# Altium project DashDataDisplay.PrjPcb (part 1 of 2)
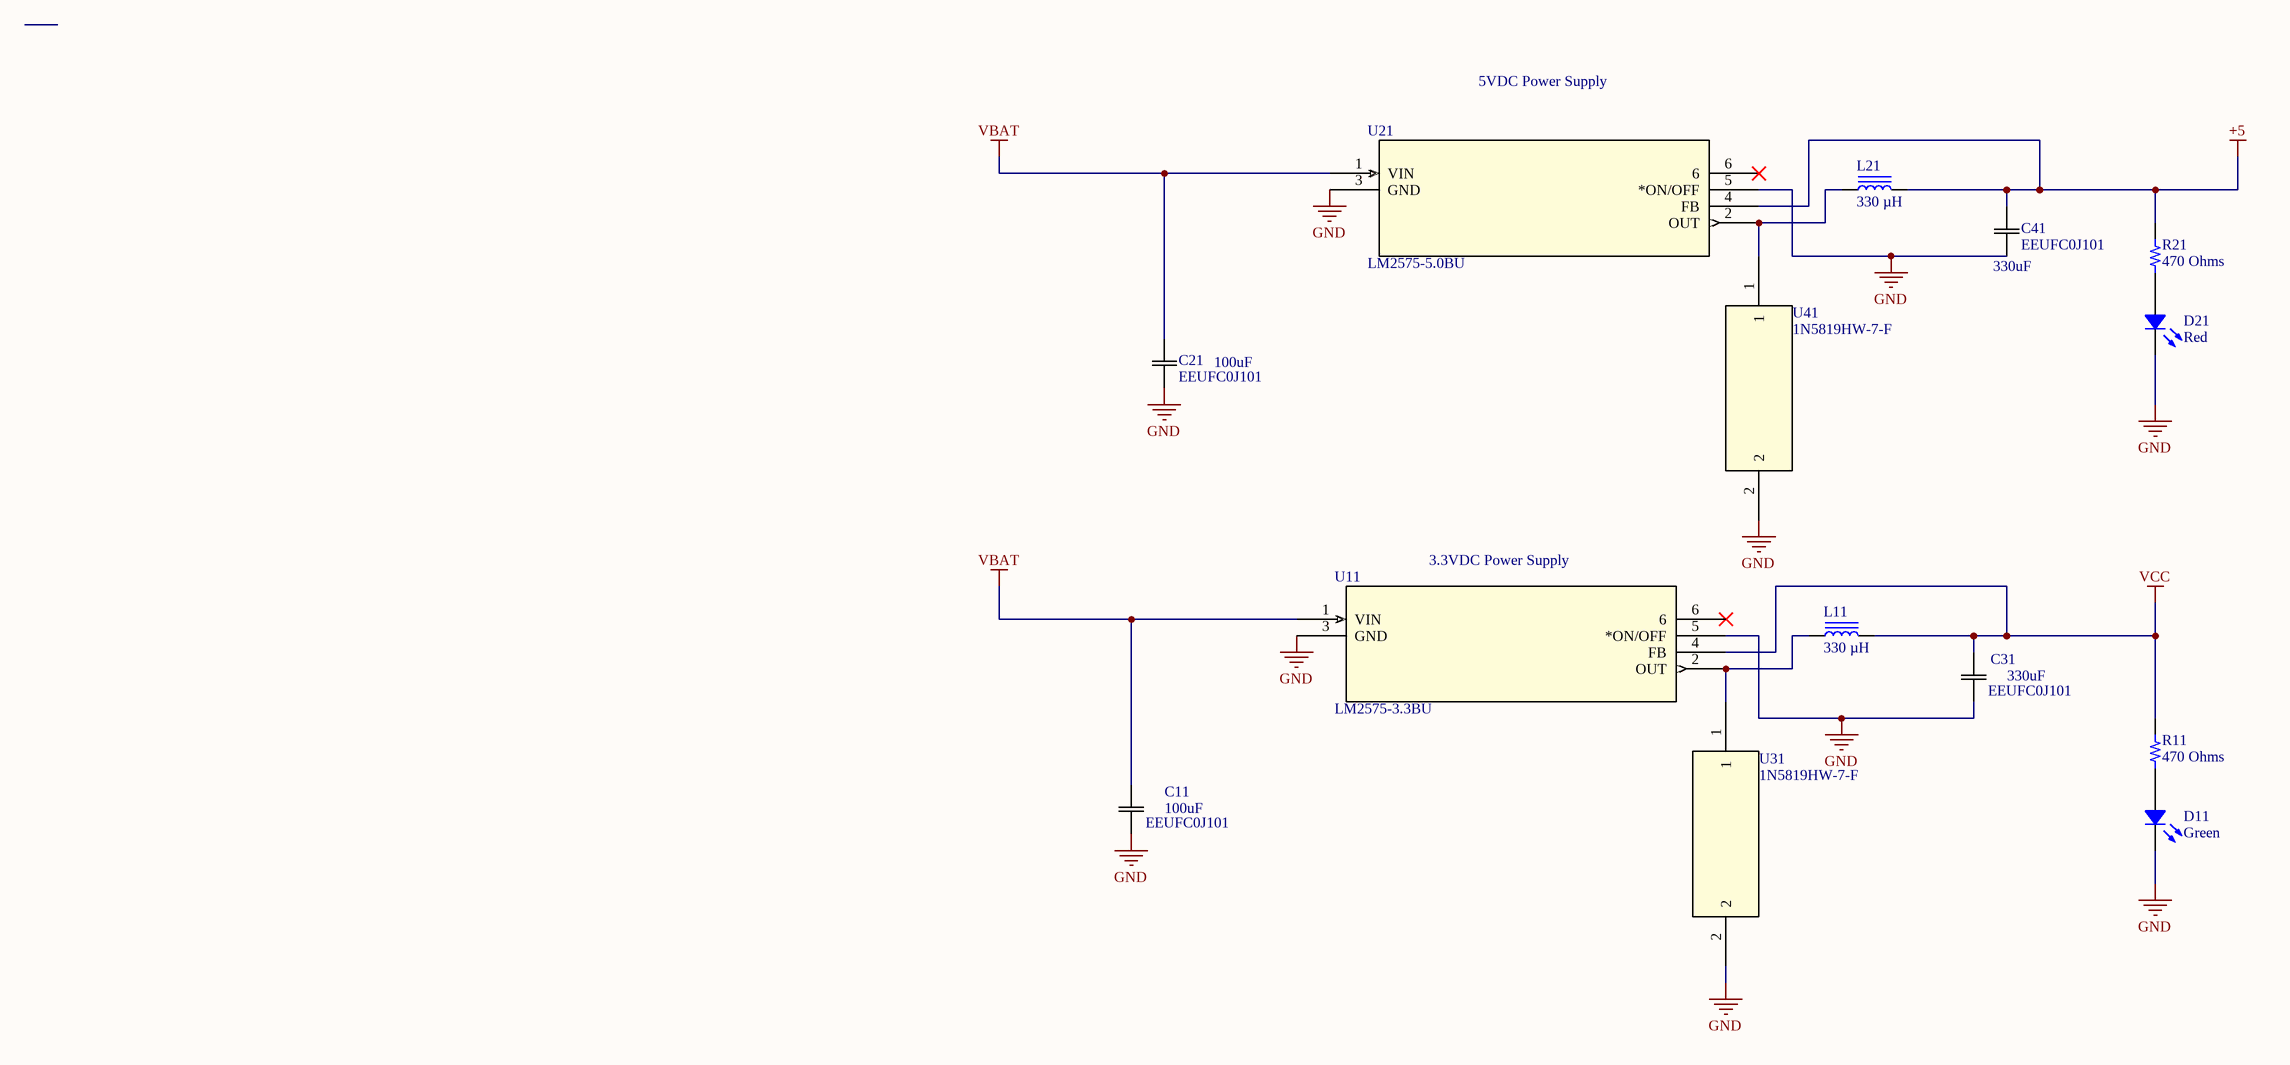
[diagram p0: PowerSupply.SchDoc]
9 sheets, 145 parts. Net scope: flat (ports and power ports of the same name join across sheets).
Board file: DashDataDisplayPCB.PcbDoc
Sheets:
  PowerSupply.SchDoc
  SensorCircuit.SchDoc
  CanTrcvCircuit.SchDoc
  LCDCircuit.SchDoc
  MCUCircuit.SchDoc
  ADCCircuit.SchDoc
  ThermoCoupleCircuit.SchDoc
  Connector.SchDoc
  ButtonCircuit.SchDoc

## Sheet PowerSupply.SchDoc
size A3; SheetNumber: 1; SheetTotal: 9

### Parts
C11  EEUFC0J101  value 100uF  [CAP_5 X 11_PAN]
C21  EEUFC0J101  value 100uF  [CAP_5 X 11_PAN]
C31  EEUFC0J101  value 330uF  [CAP_5 X 11_PAN]
C41  EEUFC0J101  value 330uF  [CAP_5 X 11_PAN]
D11  Green  [LED 1206_3216 GREEN]
D21  Red  [LED 1206_3216 RED]
L11  330 µH  [BOURNS SRR1280]
L21  330 µH  [BOURNS SRR1280]
R11  470 Ohms  [RES 0805_2012]
R21  470 Ohms  [RES 0805_2012]
U11  LM2575-3.3BU  [TO-263-5_MCL]
U21  LM2575-5.0BU  [TO-263-5_MCL-M]
U31  1N5819HW-7-F  [1N5819HW-7-F_DIO]
U41  1N5819HW-7-F  [1N5819HW-7-F_DIO]

### Nets
+5: C41.1 L21.2 R21.2 U21.4(FB)
GND: C11.2 C21.2 C31.2 C41.2 D11.2 D21.2 U11.3(GND) U11.5(*ON/OFF) U21.3(GND) U21.5(*ON/OFF) U31.2 U41.2
VBAT: C11.1 C21.1 U11.1(VIN) U21.1(VIN)
VCC: C31.1 L11.2 R11.2 U11.4(FB)
NetD11_1: D11.1 R11.1
NetD21_1: D21.1 R21.1
NetL11_1: L11.1 U11.2(OUT) U31.1
NetL21_1: L21.1 U21.2(OUT) U41.1

Not connected (* = marked no-connect by the designer): U11 6*; U21 6*

### Notes on the sheet
- 5VDC Power Supply
- (near U11) 3.3VDC Power Supply

### Library data of the parts
C11 C21 C31 C41 = EEUFC0J101: No Description Available; Mfr_Name: Panasonic
D11 = 597-6322-107F: LED GREEN 1206 SMD; Manufacturer: Dialight; Current - Test: 20mA; Lens Size: 1.20mm Dia; Lens Style: Round with Domed Top; Millicandela Rating: 1278.5mcd; Viewing Angle: 30°; Voltage - Forward (Vf) (Typ): 3.2V; Wavelength - Dominant: 525nm; Part Number: 597-6322-107F; Color: Green; ComponentLink1Description: Datasheet; ComponentLink1URL: https://s3-us-west-2.amazonaws.com/catsy.557/C18571.pdf; ComponentLink2Description: DigiKey Link; ComponentLink2URL: https://www.digikey.com/en/products/detail/dialight/597-6322-107F/16995758; Device Package: 1206 (3216 Metric); Height (Max): 1.73mm; LastUpdated: 6/3/2024 19:59:09; Lifecycle Status: Active; Minimum Order: 1; Mounting Type: Surface Mount; Package / Case: 1206 (3216 Metric); Packaging: TapeAndReel; PartId: 1292; Part Status: Active; Price: 0.17; Series: -; Size / Dimension: 3.20mm L x 1.60mm W; Supplier 1: DigiKey; Supplier Part Number 1: 350-597-6322-107FCT-ND; Supplier Device Package: 1206; Value: Green
D21 = 25-21/R6C-BR2S2B/2A: LED RED CLEAR 1206 SMD; Manufacturer: Everlight Electronics Co Ltd; Current - Test: 20mA; Lens Color: Colorless; Lens Size: 1.10mm Dia; Lens Style: Round with Domed Top; Millicandela Rating: 212.5mcd; Viewing Angle: 60°; Voltage - Forward (Vf) (Typ): 2.05V; Wavelength - Dominant: 624nm; Wavelength - Peak: 632nm; Part Number: 25-21/R6C-BR2S2B/2A; Color: Red; ComponentLink1Description: Datasheet; ComponentLink1URL: https://everlighteurope.com/index.php?controller=attachment&id_attachment=6134; ComponentLink2Description: DigiKey Link; ComponentLink2URL: https://www.digikey.com/en/products/detail/everlight-electronics-co-ltd/25-21-R6C-BR2S2B-2A/12177238; Device Package: 1206 (3216 Metric); Height (Max): 1.20mm; LastUpdated: 6/3/2024 20:00:40; Lens Transparency: Clear; Lifecycle Status: Active; Minimum Order: 1; Mounting Type: Surface Mount; Package / Case: 1206 (3216 Metric); Packaging: TapeAndReel; PartId: 1100; Part Status: Active; Price: 0.05; Series: -; Size / Dimension: 3.20mm L x 1.60mm W; Supplier 1: DigiKey; Supplier Part Number 1: 1080-25-21/R6C-BR2S2B/2ACT-ND; Supplier Device Package: 1206; Value: Red
L11 L21 = SRR1280-331K: FIXED IND 330UH 1.1A 600MOHM SMD; Manufacturer: Bourns Inc.; Current - Saturation: 1.4A; DC Resistance (DCR): 600mOhm Max; Frequency - Self Resonant: 2.9MHz; Inductance Frequency - Test: 100 kHz; Material - Core: Ferrite; Q @ Freq: 18 @ 796kHz; Shielding: Shielded; Tolerance: ±10%; Type: Drum Core, Wirewound; Part Number: SRR1280-331K; ComponentLink1Description: Datasheet; ComponentLink1URL: https://www.bourns.com/docs/Product-Datasheets/SRR1280.pdf; ComponentLink2Description: DigiKey Link; ComponentLink2URL: https://www.digikey.com/en/products/detail/bourns-inc/SRR1280-331K/1970010; Current Rating (Amps): 1.1 A; Device Package: Nonstandard; Height - Seated (Max): 0.315" (8.00mm); Inductance: 330 µH; LastUpdated: 6/3/2024 20:02:37; Lifecycle Status: Active; Minimum Order: 1; Mounting Type: Surface Mount; Operating Temperature: -40°C ~ 125°C; Package / Case: Nonstandard; Packaging: TapeAndReel; PartId: 35; Part Status: Active; Price: 0.51; Series: SRR1280; Size / Dimension: 0.492" L x 0.492" W (12.50mm x 12.50mm); Supplier 1: DigiKey; Supplier Part Number 1: SRR1280-331KLCT-ND; Value: 330 µH
R11 R21 = AC0805FR-7W470RL: RES 470 OHM 1% 1/4W 0805; Manufacturer: Yageo; Power (Watts): 0.25W, 1/4W; Temperature Coefficient: ±100ppm/°C; Part Number: AC0805FR-7W470RL; Value: 470 Ohms; ComponentLink1Description: Datasheet; ComponentLink1URL: https://www.yageo.com/upload/media/product/productsearch/datasheet/rchip/PYu-AC_51_RoHS_L_9.pdf; ComponentLink2Description: DigiKey Link; ComponentLink2URL: https://www.digikey.com/en/products/detail/yageo/AC0805FR-7W470RL/16982114; Composition: Thick Film; Device Package: 0805 (2012 Metric); Features: Automotive AEC-Q200, Moisture Resistant; Height - Seated (Max): 0.024" (0.60mm); LastUpdated: 2/8/2024 21:00:08; Lifecycle Status: Active; Minimum Order: 1; Number of Terminations: 2; Operating Temperature: -55°C ~ 155°C; Package / Case: 0805 (2012 Metric); Packaging: TapeAndReel; PartId: 76423; Part Status: Active; Price: 0.01; Ratings: AEC-Q200; Resistance: 470 Ohms; Series: AC; Size / Dimension: 0.079" L x 0.049" W (2.00mm x 1.25mm); Supplier 1: DigiKey; Supplier Part Number 1: 13-AC0805FR-7W470RLCT-ND; Supplier Device Package: 0805; Tolerance: ±1%
U11 = LM2575-3.3BU: No Description Available; Mfr_Name: Microchip; RefDes: RefDes; Type: Type; Value: *
U21 = LM2575-5.0BU: No Description Available; Mfr_Name: Microchip; RefDes: RefDes; Type: Type
U31 U41 = 1N5819HW-7-F: No Description Available; Mfr_Name: Diodes Inc; RefDes: RefDes; Type: Type

## Sheet SensorCircuit.SchDoc
size A3; SheetNumber: 2; SheetTotal: 9
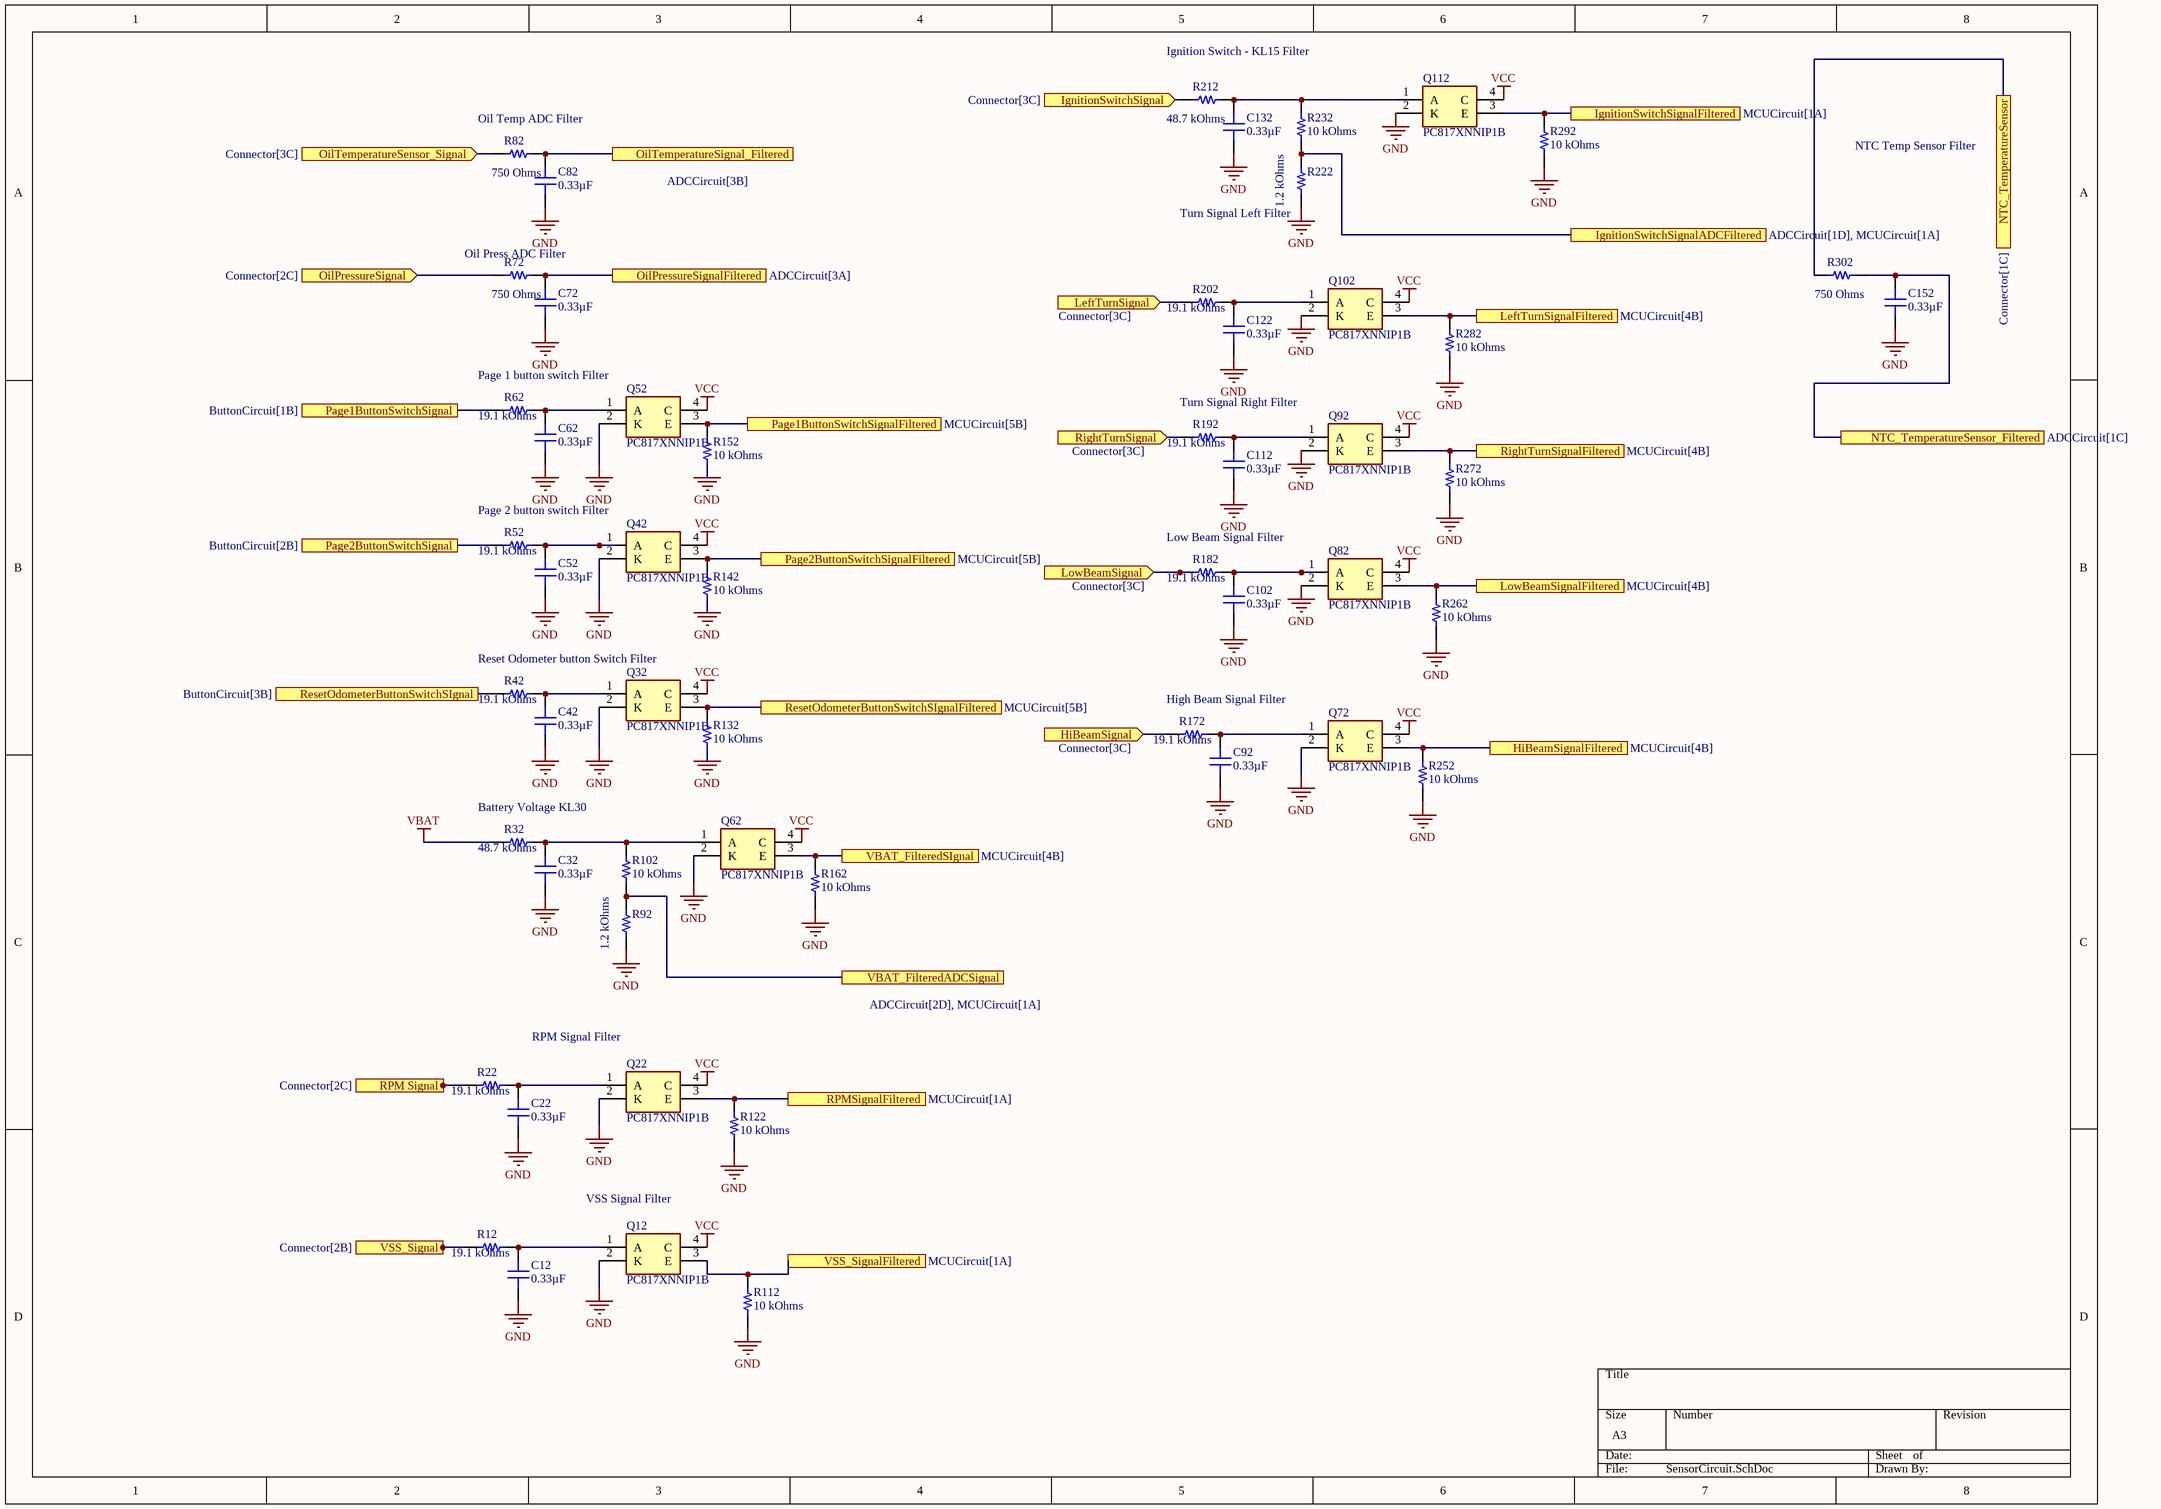
[diagram p1: SensorCircuit.SchDoc]

### Parts
C12  0.33µF  [C0805]
C22  0.33µF  [C0805]
C32  0.33µF  [C0805]
C42  0.33µF  [C0805]
C52  0.33µF  [C0805]
C62  0.33µF  [C0805]
C72  0.33µF  [C0805]
C82  0.33µF  [C0805]
C92  0.33µF  [C0805]
C102  0.33µF  [C0805]
C112  0.33µF  [C0805]
C122  0.33µF  [C0805]
C132  0.33µF  [C0805]
C152  0.33µF  [C0805]
Q12  PC817XNNIP1B  [SOP254P960X420-4N]
Q22  PC817XNNIP1B  [SOP254P960X420-4N]
Q32  PC817XNNIP1B  [SOP254P960X420-4N]
Q42  PC817XNNIP1B  [SOP254P960X420-4N]
Q52  PC817XNNIP1B  [SOP254P960X420-4N]
Q62  PC817XNNIP1B  [SOP254P960X420-4N]
Q72  PC817XNNIP1B  [SOP254P960X420-4N]
Q82  PC817XNNIP1B  [SOP254P960X420-4N]
Q92  PC817XNNIP1B  [SOP254P960X420-4N]
Q102  PC817XNNIP1B  [SOP254P960X420-4N]
Q112  PC817XNNIP1B  [SOP254P960X420-4N]
R12  19.1 kOhms  [RES 0805_2012]
R22  19.1 kOhms  [RES 0805_2012]
R32  48.7 kOhms  [RES 0805_2012]
R42  19.1 kOhms  [RES 0805_2012]
R52  19.1 kOhms  [RES 0805_2012]
R62  19.1 kOhms  [RES 0805_2012]
R72  750 Ohms  [RES 0805_2012]
R82  750 Ohms  [RES 0805_2012]
R92  1.2 kOhms  [RES 0805_2012]
R102  10 kOhms  [RES 0805_2012]
R112  10 kOhms  [RES 0805_2012]
R122  10 kOhms  [RES 0805_2012]
R132  10 kOhms  [RES 0805_2012]
R142  10 kOhms  [RES 0805_2012]
R152  10 kOhms  [RES 0805_2012]
R162  10 kOhms  [RES 0805_2012]
R172  19.1 kOhms  [RES 0805_2012]
R182  19.1 kOhms  [RES 0805_2012]
R192  19.1 kOhms  [RES 0805_2012]
R202  19.1 kOhms  [RES 0805_2012]
R212  48.7 kOhms  [RES 0805_2012]
R222  1.2 kOhms  [RES 0805_2012]
R232  10 kOhms  [RES 0805_2012]
R252  10 kOhms  [RES 0805_2012]
R262  10 kOhms  [RES 0805_2012]
R272  10 kOhms  [RES 0805_2012]
R282  10 kOhms  [RES 0805_2012]
R292  10 kOhms  [RES 0805_2012]
R302  750 Ohms  [RES 0805_2012]

### Ports
HiBeamSignal (in, see Connector[3C]), HiBeamSignalFiltered (see MCUCircuit[4B]), IgnitionSwitchSignal (in, see Connector[3C]), IgnitionSwitchSignalADCFiltered (see ADCCircuit[1D], MCUCircuit[1A]), IgnitionSwitchSignalFiltered (see MCUCircuit[1A]), LeftTurnSignal (in, see Connector[3C]), LeftTurnSignalFiltered (see MCUCircuit[4B]), LowBeamSignal (in, see Connector[3C]), LowBeamSignalFiltered (see MCUCircuit[4B]), NTC_TemperatureSensor (see Connector[1C]), NTC_TemperatureSensor_Filtered (see ADCCircuit[1C]), OilPressureSignal (in, see Connector[2C]), OilPressureSignalFiltered (see ADCCircuit[3A]), OilTemperatureSensor_Signal (in, see Connector[3C]), OilTemperatureSignal_Filtered (see ADCCircuit[3B]), Page1ButtonSwitchSignal (see ButtonCircuit[1B]), Page1ButtonSwitchSignalFiltered (see MCUCircuit[5B]), Page2ButtonSwitchSignal (see ButtonCircuit[2B]), Page2ButtonSwitchSignalFiltered (see MCUCircuit[5B]), ResetOdometerButtonSwitchSIgnal (see ButtonCircuit[3B]), ResetOdometerButtonSwitchSIgnalFiltered (see MCUCircuit[5B]), RightTurnSignal (in, see Connector[3C]), RightTurnSignalFiltered (see MCUCircuit[4B]), RPM Signal (see Connector[2C]), RPMSignalFiltered (see MCUCircuit[1A]), VBAT_FilteredADCSignal (see ADCCircuit[2D], MCUCircuit[1A]), VBAT_FilteredSIgnal (see MCUCircuit[4B]), VSS_Signal (in, see Connector[2B]), VSS_SignalFiltered (see MCUCircuit[1A])

### Nets
GND: C12.1 C22.1 C32.1 C42.1 C52.1 C62.1 C72.1 C82.1 C92.1 C102.1 C112.1 C122.1 C132.1 C152.1 Q12.2(K) Q22.2(K) Q32.2(K) Q42.2(K) Q52.2(K) Q62.2(K) Q72.2(K) Q82.2(K) Q92.2(K) Q102.2(K) Q112.2(K) R92.1 R112.1 R122.1 R132.1 R142.1 R152.1 R162.1 R222.1 R252.1 R262.1 R272.1 R282.1 R292.1
VBAT: R32.1
VCC: Q12.4(C) Q22.4(C) Q32.4(C) Q42.4(C) Q52.4(C) Q62.4(C) Q72.4(C) Q82.4(C) Q92.4(C) Q102.4(C) Q112.4(C)
NetC12_2: C12.2 Q12.1(A) R12.2
NetC22_2: C22.2 Q22.1(A) R22.2
NetC32_2: C32.2 Q62.1(A) R32.2 R102.2
NetC42_2: C42.2 Q32.1(A) R42.2
NetC52_2: C52.2 Q42.1(A) R52.2
NetC62_2: C62.2 Q52.1(A) R62.2
NetC72_2: C72.2 R72.2 ; port OilPressureSignalFiltered
NetC82_2: C82.2 R82.2 ; port OilTemperatureSignal_Filtered
NetC92_2: C92.2 Q72.1(A) R172.2
NetC102_2: C102.2 Q82.1(A) R182.2
NetC112_2: C112.2 Q92.1(A) R192.2
NetC122_2: C122.2 Q102.1(A) R202.2
NetC132_2: C132.2 Q112.1(A) R212.2 R232.2
NetC152_2: C152.2 R302.2 ; port NTC_TemperatureSensor_Filtered
NetJ18_4: R12.1 ; port VSS_Signal
NetJ18_6: R22.1 ; port RPM Signal
NetJ18_10: R72.1 ; port OilPressureSignal
NetJ18_12: R302.1 ; port NTC_TemperatureSensor
NetJ18_17: R82.1 ; port OilTemperatureSensor_Signal
NetJ18_19: R212.1 ; port IgnitionSwitchSignal
NetJ18_20: R202.1 ; port LeftTurnSignal
NetJ18_21: R192.1 ; port RightTurnSignal
NetJ18_22: R172.1 ; port HiBeamSignal
NetJ18_23: R182.1 ; port LowBeamSignal
NetQ12_3: Q12.3(E) R112.2 ; port VSS_SignalFiltered
NetQ22_3: Q22.3(E) R122.2 ; port RPMSignalFiltered
NetQ32_3: Q32.3(E) R132.2 ; port ResetOdometerButtonSwitchSIgnalFiltered
NetQ42_3: Q42.3(E) R142.2 ; port Page2ButtonSwitchSignalFiltered
NetQ52_3: Q52.3(E) R152.2 ; port Page1ButtonSwitchSignalFiltered
NetQ62_3: Q62.3(E) R162.2 ; port VBAT_FilteredSIgnal
NetQ72_3: Q72.3(E) R252.2 ; port HiBeamSignalFiltered
NetQ82_3: Q82.3(E) R262.2 ; port LowBeamSignalFiltered
NetQ92_3: Q92.3(E) R272.2 ; port RightTurnSignalFiltered
NetQ102_3: Q102.3(E) R282.2 ; port LeftTurnSignalFiltered
NetQ112_3: Q112.3(E) R292.2 ; port IgnitionSwitchSignalFiltered
NetR42_1: R42.1 ; port ResetOdometerButtonSwitchSIgnal
NetR52_1: R52.1 ; port Page2ButtonSwitchSignal
NetR62_1: R62.1 ; port Page1ButtonSwitchSignal
NetR92_2: R92.2 R102.1 ; port VBAT_FilteredADCSignal
NetR222_2: R222.2 R232.1 ; port IgnitionSwitchSignalADCFiltered

### Notes on the sheet
- Ignition Switch - KL15 Filter
- Oil Temp ADC Filter
- NTC Temp Sensor Filter
- (near R222) Turn Signal Left Filter
- (near R72) Oil Press ADC Filter
- Page 1 button switch Filter
- Turn Signal Right Filter
- Page 2 button switch Filter
- Low Beam Signal Filter
- Reset Odometer button Switch Filter
- High Beam Signal Filter
- Battery Voltage KL30
- RPM Signal Filter
- (near Q12) VSS Signal Filter

### Library data of the parts
C12 C22 C32 C42 C52 C62 C72 C82 C92 C102 C112 C122 C132 C152 = 0805YC334JAT2A: CAP CER 0.33UF 16V X7R 0805; manufacturer: AVX Corporation; Tolerance: ±5%; Part Number: 0805YC334JAT2A; Value: 0.33µF; Applications: General Purpose; Capacitance: 0.33µF; componentlink1description: Datasheet; componentlink1url: http://datasheets.avx.com/X7RDielectric.pdf; componentlink2description: DigiKey Link; componentlink2url: http://digikey.com/product-detail/en/avx-corporation/0805YC334JAT2A/478-5273-1-ND/1950940; Device Package: 0805 (2012 Metric); lastupdated: 9/2/2020 01:04:40; Lifecycle Status: Active; Minimum Order: 1; Mounting Type: Surface Mount, MLCC; Operating Temperature: -55°C ~ 125°C; Package / Case: 0805 (2012 Metric); packaging: TapeAndReel; partid: 3309; Part Status: Active; price: 0.15; series: -; Size / Dimension: 0.079" L x 0.049" W (2.01mm x 1.25mm); Supplier 1: DigiKey; Supplier Part Number 1: 478-5273-1-ND; Temperature Coefficient: X7R; Thickness (Max): 0.055" (1.40mm); Voltage - Rated: 16V
Q12 Q22 Q32 Q42 Q52 Q62 Q72 Q82 Q92 Q102 Q112 = PC817XNNIP1B: Phototransistor; Manufacturer_Name: Sharp Microelectronics; Datasheet Link: https://www.mouser.com/datasheet/2/365/SHARP_PC817XNNIP1B-1360398.pdf; Height: 4.2mm; Manufacturer_Part_Number: PC817XNNIP1B; Mouser Part Number: 852-PC817XNNIP1B; Mouser Price/Stock: https://www.mouser.co.uk/ProductDetail/Sharp-Microelectronics/PC817XNNIP1B?qs=rrS6PyfT74dJvnx7366b6Q%3D%3D; Arrow Part Number: PC817XNNIP1B; Arrow Price/Stock: https://www.arrow.com/en/products/pc817xnnip1b/sharp
R12 R22 R42 R52 R62 R172 R182 R192 R202 = CRCW080519K1FKEA: RES SMD 19.1K OHM 1% 1/8W 0805; Manufacturer: Vishay Dale; Power (Watts): 0.125W, 1/8W; Temperature Coefficient: ±100ppm/°C; Part Number: CRCW080519K1FKEA; Value: 19.1 kOhms; ComponentLink1Description: Datasheet; ComponentLink1URL: http://www.vishay.com/docs/20035/dcrcwe3.pdf; ComponentLink2Description: DigiKey Link; ComponentLink2URL: https://www.digikey.com/en/products/detail/vishay-dale/CRCW080519K1FKEA/1175781; Composition: Thick Film; Device Package: 0805 (2012 Metric); Features: Automotive AEC-Q200; Height - Seated (Max): 0.020" (0.50mm); LastUpdated: 2/8/2024 21:02:03; Lifecycle Status: Active; Minimum Order: 1; Number of Terminations: 2; Operating Temperature: -55°C ~ 155°C; Package / Case: 0805 (2012 Metric); Packaging: TapeAndReel; PartId: 35928; Part Status: Active; Price: 0.01; Ratings: AEC-Q200; Resistance: 19.1 kOhms; Series: CRCW; Size / Dimension: 0.079" L x 0.049" W (2.00mm x 1.25mm); Supplier 1: DigiKey; Supplier Part Number 1: 541-19.1KCCT-ND; Supplier Device Package: 0805; Tolerance: ±1%
R32 R212 = CRCW080548K7FKEA: RES SMD 48.7K OHM 1% 1/8W 0805; Manufacturer: Vishay Dale; Power (Watts): 0.125W, 1/8W; Temperature Coefficient: ±100ppm/°C; Part Number: CRCW080548K7FKEA; Value: 48.7 kOhms; ComponentLink1Description: Datasheet; ComponentLink1URL: http://www.vishay.com/docs/20035/dcrcwe3.pdf; ComponentLink2Description: DigiKey Link; ComponentLink2URL: https://www.digikey.com/en/products/detail/vishay-dale/CRCW080548K7FKEA/1175829; Composition: Thick Film; Device Package: 0805 (2012 Metric); Features: Automotive AEC-Q200; Height - Seated (Max): 0.020" (0.50mm); LastUpdated: 2/8/2024 21:02:03; Lifecycle Status: Active; Minimum Order: 1; Number of Terminations: 2; Operating Temperature: -55°C ~ 155°C; Package / Case: 0805 (2012 Metric); Packaging: TapeAndReel; PartId: 35941; Part Status: Active; Price: 0.01; Ratings: AEC-Q200; Resistance: 48.7 kOhms; Series: CRCW; Size / Dimension: 0.079" L x 0.049" W (2.00mm x 1.25mm); Supplier 1: DigiKey; Supplier Part Number 1: 541-48.7KCCT-ND; Supplier Device Package: 0805; Tolerance: ±1%
R72 R82 R302 = RNCF0805BTE750R: RES 750 OHM 0.1% 1/8W 0805; Manufacturer: Stackpole Electronics Inc; Power (Watts): 0.125W, 1/8W; Temperature Coefficient: ±25ppm/°C; Part Number: RNCF0805BTE750R; Value: 750 Ohms; ComponentLink1Description: Datasheet; ComponentLink1URL: https://www.seielect.com/catalog/sei-rncf.pdf; ComponentLink2Description: DigiKey Link; ComponentLink2URL: http://digikey.com/product-detail/en/stackpole-electronics-inc/RNCF0805BTE750R/RNCF0805BTE750RCT-ND/2027163; Composition: Thin Film; Device Package: 0805 (2012 Metric); Features: Automotive AEC-Q200; Height - Seated (Max): 0.026" (0.65mm); LastUpdated: 2/8/2024 21:02:34; Lifecycle Status: Active; Minimum Order: 1; Number of Terminations: 2; Operating Temperature: -55°C ~ 155°C; Package / Case: 0805 (2012 Metric); Packaging: TapeAndReel; PartId: 28885; Part Status: Active; Price: 0.08; Ratings: AEC-Q200; Resistance: 750 Ohms; Series: RNCF; Size / Dimension: 0.079" L x 0.049" W (2.00mm x 1.25mm); Supplier 1: DigiKey; Supplier Part Number 1: RNCF0805BTE750RCT-ND; Supplier Device Package: 0805; Tolerance: ±0.1%
R92 R222 = CPF0805B1K2E1: RES SMD 1.2K OHM 0.1% 1/10W 0805; Manufacturer: TE Connectivity Passive Product; Power (Watts): 0.1W, 1/10W; Temperature Coefficient: ±25ppm/°C; Part Number: CPF0805B1K2E1; Value: 1.2 kOhms; ComponentLink1Description: Datasheet; ComponentLink1URL: https://www.te.com/commerce/DocumentDelivery/DDEController?Action=srchrtrv&DocNm=1773200&DocType=DS&DocLang=English; ComponentLink2Description: DigiKey Link; ComponentLink2URL: https://www.digikey.com/en/products/detail/te-connectivity-passive-product/CPF0805B1K2E1/2382033; Composition: Thin Film; Device Package: 0805 (2012 Metric); Height - Seated (Max): 0.026" (0.65mm); LastUpdated: 2/8/2024 21:00:58; Lifecycle Status: Active; Minimum Order: 1; Number of Terminations: 2; Operating Temperature: -55°C ~ 155°C; Package / Case: 0805 (2012 Metric); Packaging: TapeAndReel; PartId: 48602; Part Status: Active; Price: 0.12; Resistance: 1.2 kOhms; Series: CPF, Neohm; Size / Dimension: 0.079" L x 0.049" W (2.00mm x 1.25mm); Supplier 1: DigiKey; Supplier Part Number 1: A103167CT-ND; Supplier Device Package: 0805; Tolerance: ±0.1%
R102 R232 = 9-2176375-1: RES 10K OHM 0.1% 1/5W 0805; Manufacturer: TE Connectivity Passive Product; Power (Watts): 0.2W, 1/5W; Temperature Coefficient: ±10ppm/°C; Part Number: 9-2176375-1; Value: 10 kOhms; ComponentLink1Description: Datasheet; ComponentLink1URL: https://www.te.com/usa-en/product-9-2176375-1.datasheet.pdf; ComponentLink2Description: DigiKey Link; ComponentLink2URL: https://www.digikey.com/en/products/detail/te-connectivity-passive-product/9-2176375-1/18110542; Composition: Thin Film; Device Package: 0805 (2012 Metric); Features: Anti-Sulfur, Automotive AEC-Q200, Moisture Resistant; Height - Seated (Max): 0.026" (0.65mm); LastUpdated: 2/8/2024 21:00:11; Lifecycle Status: Active; Minimum Order: 1; Number of Terminations: 2; Operating Temperature: -55°C ~ 155°C; Package / Case: 0805 (2012 Metric); Packaging: TapeAndReel; PartId: 76290; Part Status: Active; Price: 0.39; Ratings: AEC-Q200; Resistance: 10 kOhms; Series: RQ73; Size / Dimension: 0.079" L x 0.049" W (2.00mm x 1.25mm); Supplier 1: DigiKey; Supplier Part Number 1: 1712-9-2176375-1CT-ND; Supplier Device Package: 0805; Tolerance: ±0.1%
R112 R122 R132 R142 R152 R162 R252 R262 R272 R282 R292 = 3430A2F10KTDF: 3430 A2 1% 10K 100PPM 1K RL; Manufacturer: TE Connectivity Passive Product; Power (Watts): 1W; Temperature Coefficient: ±100ppm/°C; Part Number: 3430A2F10KTDF; Value: 10 kOhms; ComponentLink2Description: DigiKey Link; ComponentLink2URL: https://www.digikey.com/en/products/detail/te-connectivity-passive-product/3430A2F10KTDF/17764190; Composition: Thick Film; Device Package: 0805 (2012 Metric); Features: Automotive AEC-Q200; Height - Seated (Max): 0.026" (0.65mm); LastUpdated: 2/8/2024 21:00:03; Lifecycle Status: Active; Minimum Order: 1; Number of Terminations: 2; Operating Temperature: -55°C ~ 155°C; Package / Case: 0805 (2012 Metric); Packaging: TapeAndReel; PartId: 77781; Part Status: Active; Price: 0.02; Ratings: AEC-Q200; Resistance: 10 kOhms; Series: 3430; Size / Dimension: 0.049" L x 0.079" W (1.25mm x 2.00mm); Supplier 1: DigiKey; Supplier Part Number 1: 1712-3430A2F10KTDFCT-ND; Supplier Device Package: 0508; Tolerance: ±1%

## Sheet CanTrcvCircuit.SchDoc
size A; SheetNumber: 3; SheetTotal: 9
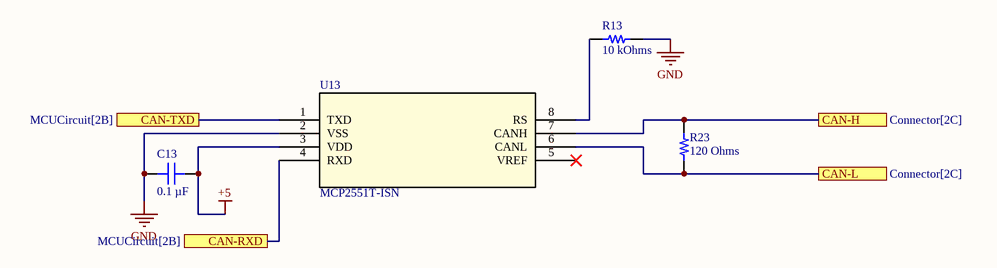
[diagram p2: CanTrcvCircuit.SchDoc]

### Parts
C13  0.1 µF  [C0805]
R13  10 kOhms  [RES 0805_2012]
R23  120 Ohms  [RES 0805_2012]
U13  MCP2551T-ISN  [SOIC8-N_MC_MCH-M]

### Ports
CAN-H (see Connector[2C]), CAN-L (see Connector[2C]), CAN-RXD (see MCUCircuit[2B]), CAN-TXD (see MCUCircuit[2B])

### Nets
+5: C13.2 U13.3(VDD)
GND: C13.1 R13.2 U13.2(VSS)
NetJ18_7: R23.2 U13.7(CANH) ; port CAN-H
NetJ18_8: R23.1 U13.6(CANL) ; port CAN-L
NetR13_1: R13.1 U13.8(RS)
NetU13_1: U13.1(TXD) ; port CAN-TXD
NetU13_4: U13.4(RXD) ; port CAN-RXD

Not connected (* = marked no-connect by the designer): U13 5(VREF)*

### Library data of the parts
C13 = 0805B104K160CT: CAP CER 0.1UF 16V X7R 0805; manufacturer: Walsin Technology Corporation; Tolerance: ±10%; Part Number: 0805B104K160CT; Value: 0.1 µF; Applications: General Purpose; Capacitance: 0.1 µF; componentlink1description: Datasheet; componentlink1url: http://www.passivecomponent.com/wp-content/uploads/2018/10/MLCC.pdf; componentlink2description: DigiKey Link; componentlink2url: https://www.digikey.com/en/products/detail/walsin-technology-corporation/0805B104K160CT/9355062; Device Package: 0805 (2012 Metric); lastupdated: 2/9/2024 20:16:02; Lifecycle Status: Active; Minimum Order: 1; Mounting Type: Surface Mount, MLCC; Operating Temperature: -55°C ~ 125°C; Package / Case: 0805 (2012 Metric); packaging: TapeAndReel; partid: 4882; Part Status: Active; price: 0.01; series: -; Size / Dimension: 0.079" L x 0.049" W (2.00mm x 1.25mm); Supplier 1: DigiKey; Supplier Part Number 1: 1292-1565-1-ND; Temperature Coefficient: X7R; Thickness (Max): 0.035" (0.90mm); Voltage - Rated: 16V
R13 = AC0805FR-7W10KL: RES 10 KOHM 1% 1/4W 0805; Manufacturer: Yageo; Power (Watts): 0.25W, 1/4W; Temperature Coefficient: ±100ppm/°C; Part Number: AC0805FR-7W10KL; Value: 10 kOhms; ComponentLink1Description: Datasheet; ComponentLink1URL: https://www.yageo.com/upload/media/product/productsearch/datasheet/rchip/PYu-AC_51_RoHS_L_8.pdf; ComponentLink2Description: DigiKey Link; ComponentLink2URL: https://www.digikey.com/en/products/detail/yageo/AC0805FR-7W10KL/12699138; Composition: Thick Film; Device Package: 0805 (2012 Metric); Features: Automotive AEC-Q200, Moisture Resistant; Height - Seated (Max): 0.024" (0.60mm); LastUpdated: 2/8/2024 21:00:23; Lifecycle Status: Active; Minimum Order: 1; Number of Terminations: 2; Operating Temperature: -55°C ~ 155°C; Package / Case: 0805 (2012 Metric); Packaging: TapeAndReel; PartId: 68014; Part Status: Active; Price: 0.01; Ratings: AEC-Q200; Resistance: 10 kOhms; Series: AC; Size / Dimension: 0.079" L x 0.049" W (2.00mm x 1.25mm); Supplier 1: DigiKey; Supplier Part Number 1: 13-AC0805FR-7W10KLCT-ND; Supplier Device Package: 0805; Tolerance: ±1%
R23 = RC0805FR-07120RL: RES 120 OHM 1% 1/8W 0805; Manufacturer: Yageo; Power (Watts): 0.125W, 1/8W; Temperature Coefficient: ±100ppm/°C; Part Number: RC0805FR-07120RL; Value: 120 Ohms; ComponentLink1Description: Datasheet; ComponentLink1URL: https://www.yageo.com/upload/media/product/productsearch/datasheet/rchip/PYu-RC_Group_51_RoHS_L_10.pdf; ComponentLink2Description: DigiKey Link; ComponentLink2URL: https://www.digikey.com/en/products/detail/yageo/RC0805FR-07120RL/727575; Composition: Thick Film; Device Package: 0805 (2012 Metric); Features: Moisture Resistant; Height - Seated (Max): 0.024" (0.60mm); LastUpdated: 2/8/2024 21:01:49; Lifecycle Status: Active; Minimum Order: 1; Number of Terminations: 2; Operating Temperature: -55°C ~ 155°C; Package / Case: 0805 (2012 Metric); Packaging: TapeAndReel; PartId: 39440; Part Status: Active; Price: 0.01; Resistance: 120 Ohms; Series: RC_L; Size / Dimension: 0.079" L x 0.049" W (2.00mm x 1.25mm); Supplier 1: DigiKey; Supplier Part Number 1: 311-120CRCT-ND; Supplier Device Package: 0805; Tolerance: ±1%
U13 = MCP2551T-ISN: No Description Available; Mfr_Name: Microchip; RefDes: RefDes; Type: Type

## Sheet LCDCircuit.SchDoc
size A; SheetNumber: 4; SheetTotal: 9
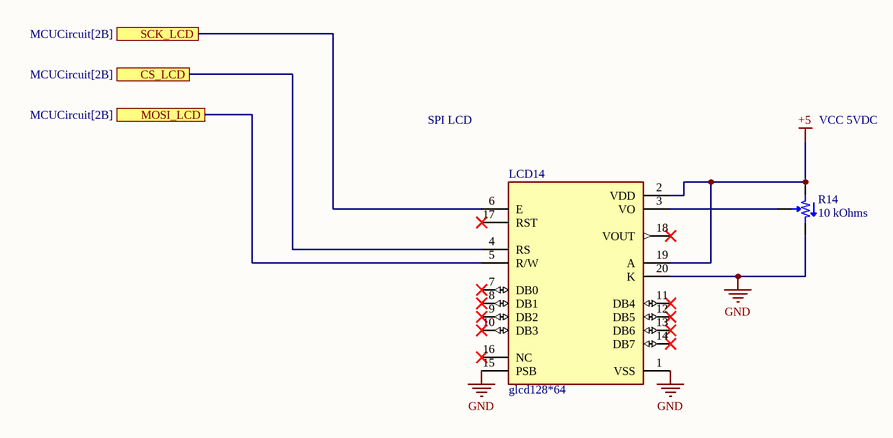
[diagram p3: LCDCircuit.SchDoc]

### Parts
LCD14  glcd128*64  [GLCD128*64]
R14  10 kOhms  [BOURNS TRIMPOT 3386P-1]

### Ports
CS_LCD (see MCUCircuit[2B]), MOSI_LCD (see MCUCircuit[2B]), SCK_LCD (see MCUCircuit[2B])

### Nets
+5: LCD14.2(VDD) LCD14.19(A) R14.1
GND: LCD14.1(VSS) LCD14.15(PSB) LCD14.20(K) R14.3
NetLCD14_3: LCD14.3(VO) R14.2
NetLCD14_4: LCD14.4(RS) ; port CS_LCD
NetLCD14_5: LCD14.5(R/W) ; port MOSI_LCD
NetLCD14_6: LCD14.6(E) ; port SCK_LCD

Not connected (* = marked no-connect by the designer): LCD14 7(DB0)* 8(DB1)* 9(DB2)* 10(DB3)* 11(DB4)* 12(DB5)* 13(DB6)* 14(DB7)* 16(NC)* 17(RST)* 18(VOUT)*

### Notes on the sheet
- SPI LCD
- VCC 5VDC

### Library data of the parts
R14 = 3386P-1-103LF: TRIMMER 10K OHM 0.5W PC PIN TOP; Manufacturer: Bourns Inc.; Adjustment Type: Top Adjustment; Number of Turns: 1; Power (Watts): 0.5W, 1/2W; Resistive Material: Cermet; Temperature Coefficient: ±100ppm/°C; Tolerance: ±10%; Part Number: 3386P-1-103LF; ComponentLink1Description: Datasheet; ComponentLink1URL: https://www.bourns.com/docs/Product-Datasheets/3386.pdf; ComponentLink2Description: DigiKey Link; ComponentLink2URL: https://www.digikey.com/en/products/detail/bourns-inc/3386P-1-103LF/1088523; LastUpdated: 3/11/2024 08:14:33; Lifecycle Status: Active; Minimum Order: 1; Mounting Type: Through Hole; Packaging: Tube; PartId: 100; Part Status: Active; Price: 0.72; Resistance: 10 kOhms; Series: Trimpot® 3386 - Sealed; Size / Dimension: Square - 0.375" x 0.375" Face (9.53mm x 9.53mm); Supplier 1: DigiKey; Supplier Part Number 1: 3386P-103LF-ND; Termination Style: PC Pins; Value: 10 kOhms

## Sheet MCUCircuit.SchDoc
size A2; SheetNumber: 5; SheetTotal: 9
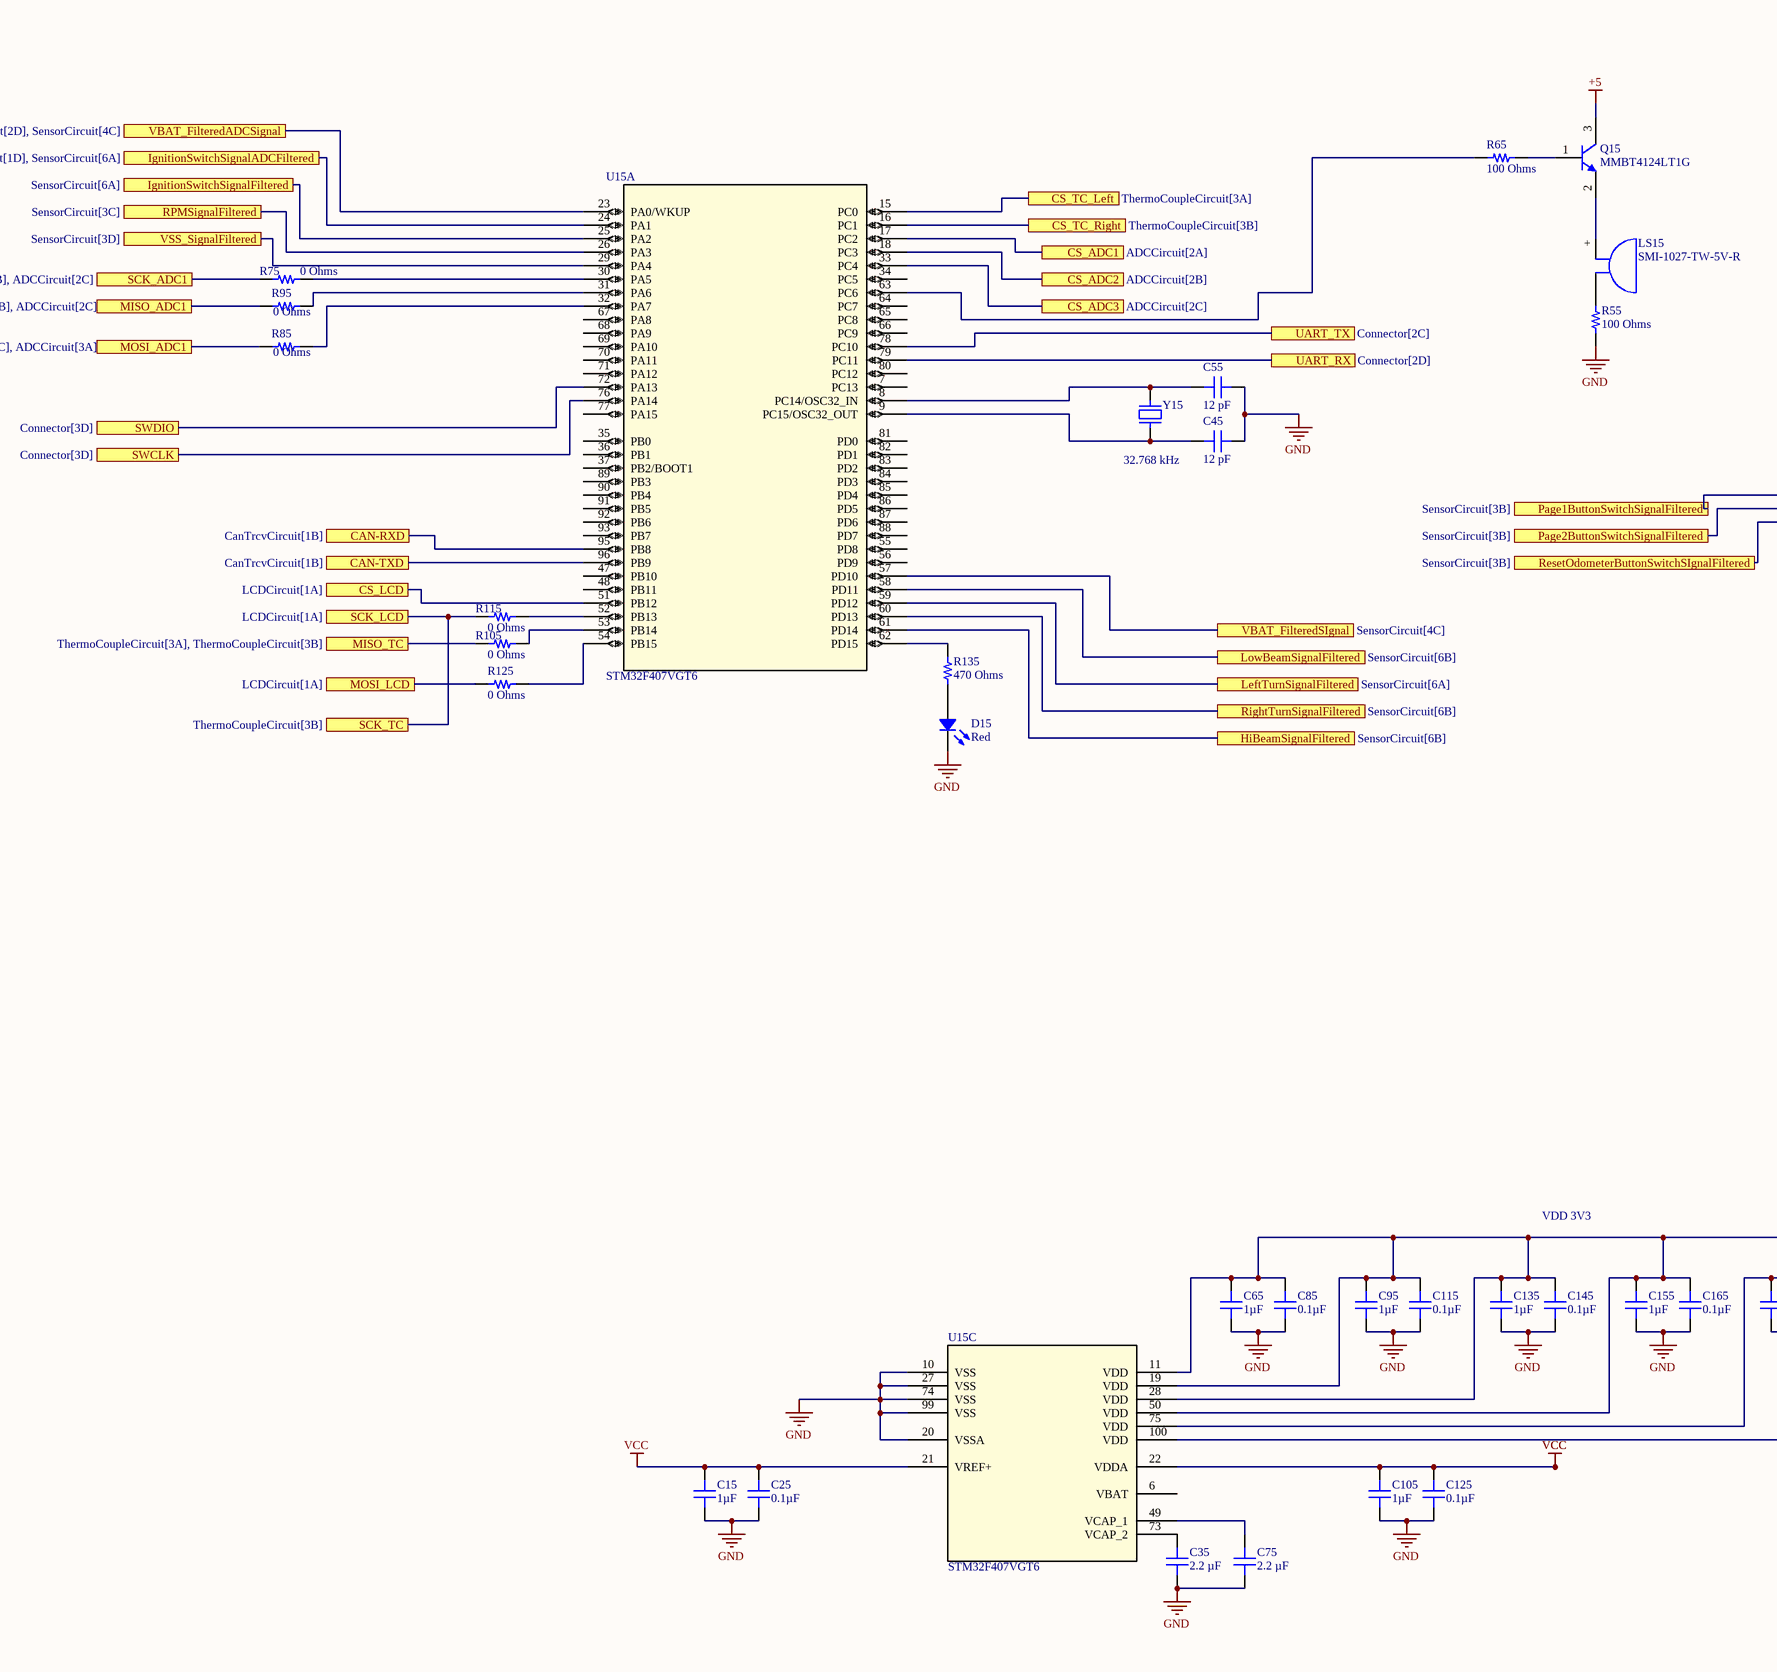
[diagram p4: MCUCircuit.SchDoc, left]
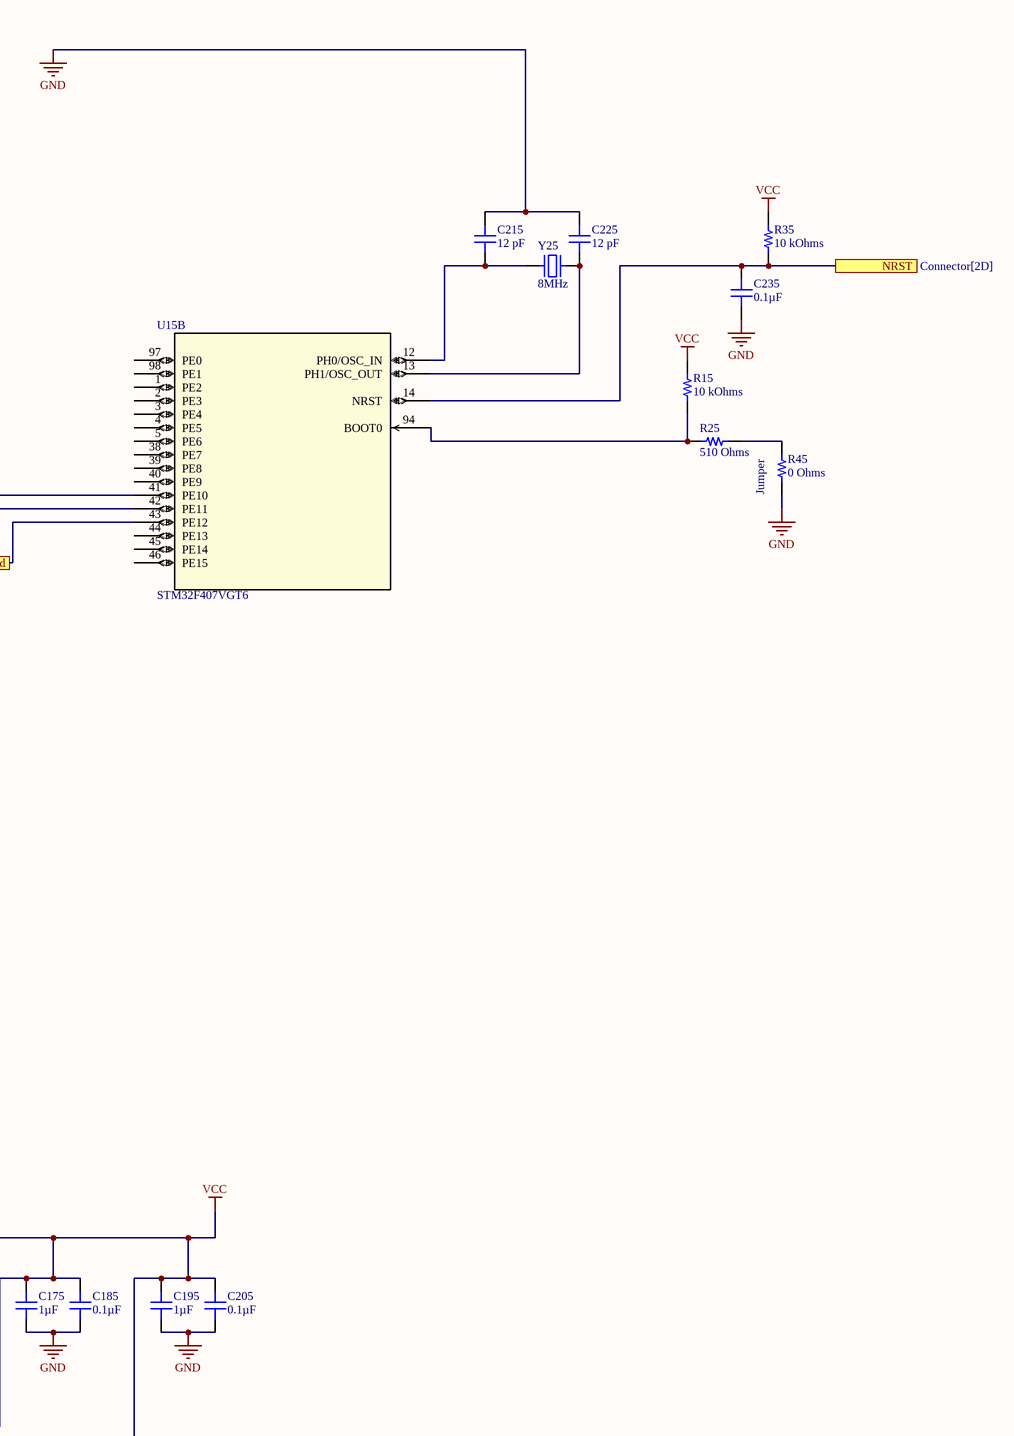
[diagram p5: MCUCircuit.SchDoc, right]

### Parts
C15  1µF  [C0805]
C25  0.1µF  [C0805]
C35  2.2 µF  [C0805]
C45  12 pF  [C0805]
C55  12 pF  [C0805]
C65  1µF  [C0805]
C75  2.2 µF  [C0805]
C85  0.1µF  [C0805]
C95  1µF  [C0805]
C105  1µF  [C0805]
C115  0.1µF  [C0805]
C125  0.1µF  [C0805]
C135  1µF  [C0805]
C145  0.1µF  [C0805]
C155  1µF  [C0805]
C165  0.1µF  [C0805]
C175  1µF  [C0805]
C185  0.1µF  [C0805]
C195  1µF  [C0805]
C205  0.1µF  [C0805]
C215  12 pF  [C0805]
C225  12 pF  [C0805]
C235  0.1µF  [C0805]
D15  Red  [LED 1206_3216 RED]
LS15  SMI-1027-TW-5V-R  [PUI Audio SMI-1027-TW-5V-R]
Q15  MMBT4124LT1G  [ON SEMI SOT-23-3]
R15  10 kOhms  [RES 0805_2012]
R25  510 Ohms  [RES 0805_2012]
R35  10 kOhms  [RES 0805_2012]
R45  0 Ohms  [RES 0805_2012]
R55  100 Ohms  [RES 0805_2012]
R65  100 Ohms  [RES 0805_2012]
R75  0 Ohms  [RES 0805_2012]
R85  0 Ohms  [RES 0805_2012]
R95  0 Ohms  [RES 0805_2012]
R105  0 Ohms  [RES 0805_2012]
R115  0 Ohms  [RES 0805_2012]
R125  0 Ohms  [RES 0805_2012]
R135  470 Ohms  [RES 0805_2012]
U15  STM32F407VGT6  [LQFP100-14x14mm]  (parts A,B,C of 3)
Y15  32.768 kHz  [MICRO CRYSTAL CM8V H0.6mm]
Y25  8MHz  [NDK NX8045GB]

### Ports
CAN-RXD (see CanTrcvCircuit[1B]), CAN-TXD (see CanTrcvCircuit[1B]), CS_ADC1 (see ADCCircuit[2A]), CS_ADC2 (see ADCCircuit[2B]), CS_ADC3 (see ADCCircuit[2C]), CS_LCD (see LCDCircuit[1A]), CS_TC_Left (see ThermoCoupleCircuit[3A]), CS_TC_Right (see ThermoCoupleCircuit[3B]), HiBeamSignalFiltered (see SensorCircuit[6B]), IgnitionSwitchSignalADCFiltered (see ADCCircuit[1D], SensorCircuit[6A]), IgnitionSwitchSignalFiltered (see SensorCircuit[6A]), LeftTurnSignalFiltered (see SensorCircuit[6A]), LowBeamSignalFiltered (see SensorCircuit[6B]), MISO_ADC1 (see ADCCircuit[2A], ADCCircuit[2B], ADCCircuit[2C]), MISO_TC (see ThermoCoupleCircuit[3A], ThermoCoupleCircuit[3B]), MOSI_ADC1 (see ADCCircuit[2B], ADCCircuit[2C], ADCCircuit[3A]), MOSI_LCD (see LCDCircuit[1A]), NRST (see Connector[2D]), Page1ButtonSwitchSignalFiltered (see SensorCircuit[3B]), Page2ButtonSwitchSignalFiltered (see SensorCircuit[3B]), ResetOdometerButtonSwitchSIgnalFiltered (see SensorCircuit[3B]), RightTurnSignalFiltered (see SensorCircuit[6B]), RPMSignalFiltered (see SensorCircuit[3C]), SCK_ADC1 (see ADCCircuit[2A], ADCCircuit[2B], ADCCircuit[2C]), SCK_LCD (see LCDCircuit[1A]), SCK_TC (see ThermoCoupleCircuit[3B]), SWCLK (see Connector[3D]), SWDIO (see Connector[3D]), UART_RX (see Connector[2D]), UART_TX (see Connector[2C]), VBAT_FilteredADCSignal (see ADCCircuit[2D], SensorCircuit[4C]), VBAT_FilteredSIgnal (see SensorCircuit[4C]), VSS_SignalFiltered (see SensorCircuit[3D])

### Nets
+5: Q15.3(C)
GND: C15.1 C25.1 C35.2 C45.2 C55.2 C65.1 C75.2 C85.1 C95.1 C105.1 C115.1 C125.1 C135.1 C145.1 C155.1 C165.1 C175.1 C185.1 C195.1 C205.1 C215.2 C225.2 C235.1 D15.2 R45.1 R55.1 U15.10(VSS) U15.20(VSSA) U15.27(VSS) U15.74(VSS) U15.99(VSS)
VCC: C15.2 C25.2 C65.2 C85.2 C95.2 C105.2 C115.2 C125.2 C135.2 C145.2 C155.2 C165.2 C175.2 C185.2 C195.2 C205.2 R15.2 R35.2 U15.11(VDD) U15.19(VDD) U15.21(VREF+) U15.22(VDDA) U15.28(VDD) U15.50(VDD) U15.75(VDD) U15.100(VDD)
NetC35_1: C35.1 U15.73(VCAP_2)
NetC45_1: C45.1 U15.9(PC15/OSC32_OUT) Y15.1
NetC55_1: C55.1 U15.8(PC14/OSC32_IN) Y15.2
NetC75_1: C75.1 U15.49(VCAP_1)
NetC215_1: C215.1 U15.12(PH0/OSC_IN) Y25.1
NetC225_1: C225.1 U15.13(PH1/OSC_OUT) Y25.2
NetC235_2: C235.2 R35.1 U15.14(NRST) ; port NRST
NetD15_1: D15.1 R135.1
NetJ28_2: U15.72(PA13) ; port SWDIO
NetJ28_4: U15.76(PA14) ; port SWCLK
NetJ38_1: U15.79(PC11) ; port UART_RX
NetJ38_2: U15.78(PC10) ; port UART_TX
NetLCD14_4: U15.51(PB12) ; port CS_LCD
NetLCD14_5: R125.1 ; port MOSI_LCD
NetLCD14_6: R115.1 ; port SCK_LCD, port SCK_TC
NetLS15_+: LS15.+ Q15.2(E)
NetLS15_-: LS15.- R55.2
NetQ12_3: U15.29(PA4) ; port VSS_SignalFiltered
NetQ15_1: Q15.1(B) R65.1
NetQ22_3: U15.26(PA3) ; port RPMSignalFiltered
NetQ32_3: U15.43(PE12) ; port ResetOdometerButtonSwitchSIgnalFiltered
NetQ42_3: U15.42(PE11) ; port Page2ButtonSwitchSignalFiltered
NetQ52_3: U15.41(PE10) ; port Page1ButtonSwitchSignalFiltered
NetQ62_3: U15.57(PD10) ; port VBAT_FilteredSIgnal
NetQ72_3: U15.61(PD14) ; port HiBeamSignalFiltered
NetQ82_3: U15.58(PD11) ; port LowBeamSignalFiltered
NetQ92_3: U15.60(PD13) ; port RightTurnSignalFiltered
NetQ102_3: U15.59(PD12) ; port LeftTurnSignalFiltered
NetQ112_3: U15.25(PA2) ; port IgnitionSwitchSignalFiltered
NetR15_1: R15.1 R25.1 U15.94(BOOT0)
NetR25_2: R25.2 R45.2
NetR65_2: R65.2 U15.63(PC6)
NetR75_1: R75.1 ; port SCK_ADC1
NetR75_2: R75.2 U15.30(PA5)
NetR85_1: R85.1 ; port MOSI_ADC1
NetR85_2: R85.2 U15.32(PA7)
NetR92_2: U15.23(PA0/WKUP) ; port VBAT_FilteredADCSignal
NetR95_1: R95.1 ; port MISO_ADC1
NetR95_2: R95.2 U15.31(PA6)
NetR105_1: R105.1 ; port MISO_TC
NetR105_2: R105.2 U15.53(PB14)
NetR115_2: R115.2 U15.52(PB13)
NetR125_2: R125.2 U15.54(PB15)
NetR135_2: R135.2 U15.62(PD15)
NetR222_2: U15.24(PA1) ; port IgnitionSwitchSignalADCFiltered
NetU13_1: U15.96(PB9) ; port CAN-TXD
NetU13_4: U15.95(PB8) ; port CAN-RXD
NetU15_15: U15.15(PC0) ; port CS_TC_Left
NetU15_16: U15.16(PC1) ; port CS_TC_Right
NetU15_17: U15.17(PC2) ; port CS_ADC1
NetU15_18: U15.18(PC3) ; port CS_ADC2
NetU15_33: U15.33(PC4) ; port CS_ADC3

Not connected (* = marked no-connect by the designer): U15 1(PE2) 2(PE3) 3(PE4) 4(PE5) 5(PE6) 6(VBAT) 7(PC13) 34(PC5) 35(PB0) 36(PB1) 37(PB2/BOOT1) 38(PE7) 39(PE8) 40(PE9) 44(PE13) 45(PE14) 46(PE15) 47(PB10) 48(PB11) 55(PD8) 56(PD9) 64(PC7) 65(PC8) 66(PC9) 67(PA8) 68(PA9) 69(PA10) 70(PA11) 71(PA12) 77(PA15) 80(PC12) 81(PD0) 82(PD1) 83(PD2) 84(PD3) 85(PD4) 86(PD5) 87(PD6) 88(PD7) 89(PB3) 90(PB4) 91(PB5) 92(PB6) 93(PB7) 97(PE0) 98(PE1)

### Notes on the sheet
- (near R45) Jumper
- VDD 3V3

### Library data of the parts
C15 C65 C95 C105 C135 C155 C175 C195 = LGC26D105MAT2S1: CAP CER 1UF 6.3V X5R 0805; manufacturer: AVX Corporation; Tolerance: ±20%; Part Number: LGC26D105MAT2S1; Value: 1µF; Applications: Bypass, Decoupling; Capacitance: 1µF; componentlink1description: Datasheet; componentlink1url: http://datasheets.avx.com/LGA.pdf; componentlink2description: DigiKey Link; componentlink2url: http://digikey.com/product-detail/en/avx-corporation/LGC26D105MAT2S1/478-6694-1-ND/2694148; Device Package: 0805 (2012 Metric); Features: Low ESL (Multi-Terminal); lastupdated: 9/2/2020 01:04:42; Lifecycle Status: Active; Minimum Order: 1; Mounting Type: Surface Mount, MLCC; Operating Temperature: -55°C ~ 85°C; Package / Case: 0805 (2012 Metric); packaging: TapeAndReel; partid: 2463; Part Status: Active; price: 0.63; series: LGC2 (LGA); Size / Dimension: 0.081" L x 0.052" W (2.06mm x 1.32mm); Supplier 1: DigiKey; Supplier Part Number 1: 478-6694-1-ND; Temperature Coefficient: X5R; Thickness (Max): 0.022" (0.55mm); Voltage - Rated: 6.3V
C25 C85 C115 C125 C145 C165 C185 C205 C235 = 08056C104JAZ2A: CAP CER 0.1UF 6.3V X7R 0805; manufacturer: AVX Corporation; Tolerance: ±5%; Part Number: 08056C104JAZ2A; Value: 0.1µF; Applications: Boardflex Sensitive; Capacitance: 0.1µF; componentlink1description: Datasheet; componentlink1url: http://datasheets.avx.com/FlexitermMLCC.pdf; componentlink2description: DigiKey Link; componentlink2url: http://digikey.com/product-detail/en/avx-corporation/08056C104JAZ2A/478-11914-1-ND/8573550; Device Package: 0805 (2012 Metric); Features: Soft Termination; lastupdated: 9/2/2020 01:04:11; Lifecycle Status: Active; Minimum Order: 1; Mounting Type: Surface Mount, MLCC; Operating Temperature: -55°C ~ 125°C; Package / Case: 0805 (2012 Metric); packaging: TapeAndReel; partid: 16783; Part Status: Active; price: 0.08; series: FLEXITERM®; Size / Dimension: 0.079" L x 0.049" W (2.01mm x 1.25mm); Supplier 1: DigiKey; Supplier Part Number 1: 478-11914-1-ND; Temperature Coefficient: X7R; Voltage - Rated: 6.3V
C35 C75 = VJ0805G225KXYTW1BC: CAP CER 2.2UF 6.3V X5R 0805; manufacturer: Vishay Vitramon; Tolerance: ±10%; Part Number: VJ0805G225KXYTW1BC; Value: 2.2 µF; Applications: General Purpose; Capacitance: 2.2 µF; componentlink1description: Datasheet; componentlink1url: https://www.vishay.com/docs/28548/vjw1bcbascomseries.pdf; componentlink2description: DigiKey Link; componentlink2url: https://www.digikey.com/en/products/detail/vishay-vitramon/VJ0805G225KXYTW1BC/8310442; Device Package: 0805 (2012 Metric); lastupdated: 2/9/2024 20:16:05; Lifecycle Status: Active; Minimum Order: 1; Mounting Type: Surface Mount, MLCC; Operating Temperature: -55°C ~ 85°C; Package / Case: 0805 (2012 Metric); packaging: TapeAndReel; partid: 3978; Part Status: Active; price: 0.08; series: VJ W1BC; Size / Dimension: 0.079" L x 0.049" W (2.00mm x 1.25mm); Supplier 1: DigiKey; Supplier Part Number 1: 720-1727-1-ND; Temperature Coefficient: X5R; Thickness (Max): 0.057" (1.45mm); Voltage - Rated: 6.3V
C45 C55 C215 C225 = C0805C120J8HAC7800: CAP CER 12PF 10V X8R 0805; manufacturer: KEMET; Tolerance: ±5%; Part Number: C0805C120J8HAC7800; Value: 12 pF; Applications: General Purpose; Capacitance: 12 pF; componentlink1description: Datasheet; componentlink1url: https://api.kemet.com/component-edge/download/datasheet/C0805C120J8HAC7800.pdf; componentlink2description: DigiKey Link; componentlink2url: https://www.digikey.com/en/products/detail/kemet/C0805C120J8HAC7800/7948305; Device Package: 0805 (2012 Metric); Features: Low ESL, High Temperature; lastupdated: 2/9/2024 20:15:06; Lifecycle Status: Active; Minimum Order: 1; Mounting Type: Surface Mount, MLCC; Operating Temperature: -55°C ~ 150°C; Package / Case: 0805 (2012 Metric); packaging: TapeAndReel; partid: 32071; Part Status: Active; price: 0.01; series: SMD Comm X8R HT150C; Size / Dimension: 0.079" L x 0.049" W (2.00mm x 1.25mm); Supplier 1: DigiKey; Supplier Part Number 1: 399-C0805C120J8HAC7800CT-ND; Temperature Coefficient: X8R; Thickness (Max): 0.035" (0.88mm); Voltage - Rated: 10V
D15 = 25-21/R6C-BR2S2B/2A: as D21 on sheet PowerSupply; Part Number: 25-21/R6C-BR2S2B/2A; Color: Red; ComponentLink1Description: Datasheet; ComponentLink1URL: https://everlighteurope.com/index.php?controller=attachment&id_attachment=6134; ComponentLink2Description: DigiKey Link; ComponentLink2URL: https://www.digikey.com/en/products/detail/everlight-electronics-co-ltd/25-21-R6C-BR2S2B-2A/12177238; Device Package: 1206 (3216 Metric); Height (Max): 1.20mm; LastUpdated: 6/3/2024 20:00:40; Lens Transparency: Clear; Lifecycle Status: Active; Minimum Order: 1; Mounting Type: Surface Mount; Package / Case: 1206 (3216 Metric); Packaging: TapeAndReel; PartId: 1100; Part Status: Active; Price: 0.05; Series: -; Size / Dimension: 3.20mm L x 1.60mm W; Supplier 1: DigiKey; Supplier Part Number 1: 1080-25-21/R6C-BR2S2B/2ACT-ND; Supplier Device Package: 1206; Value: Red
LS15 = SMI-1027-TW-5V-R: AUDIO MAGNETIC IND 4-7V SMD; Manufacturer: PUI Audio, Inc.; Current - Supply: 30mA; Driver Circuitry: Indicator, Internally Driven; Frequency: 2.7kHz; Input Type: DC; Operating Mode: Single Tone; Port Location: Top; Ratings: Washable; Sound Pressure Level (SPL): 80dB @ 5V, 10cm; Voltage Range: 4 ~ 7V; Voltage - Rated: 5V; Part Number: SMI-1027-TW-5V-R; ComponentLink1Description: Datasheet; ComponentLink1URL: http://www.puiaudio.com/pdf/SMI-1027-TW-5V-R.pdf; ComponentLink2Description: DigiKey Link; ComponentLink2URL: http://digikey.com/product-detail/en/pui-audio-inc/SMI-1027-TW-5V-R/668-1537-1-ND/6021768; Height - Seated (Max): 0.209" (5.30mm); LastUpdated: 4/24/2020 00:38:54; Lifecycle Status: Active; Minimum Order: 1; Mounting Type: Surface Mount; Operating Temperature: -40°C ~ 85°C; Packaging: TapeAndReel; Part Status: Active; Price: 2.15; Series: SMI; Size / Dimension: 0.378" L x 0.378" W (9.60mm x 9.60mm); Supplier 1: DigiKey; Supplier Part Number 1: 668-1537-1-ND; Technology: Magnetic; Termination: Solder Pads
Q15 = MMBT4124LT1G: TRANS NPN 25V 0.2A SOT23-3; Manufacturer: ON Semiconductor; Current - Collector Cutoff (Max): 50nA (ICBO); Current - Collector (Ic) (Max): 200mA; DC Current Gain (hFE) (Min) @ Ic, Vce: 120 @ 2mA, 1V; Frequency - Transition: 300MHz; Power - Max: 225mW; Vce Saturation (Max) @ Ib, Ic: 300mV @ 5mA, 50mA; Part Number: MMBT4124LT1G; ComponentLink1Description: Datasheet; ComponentLink1URL: http://www.onsemi.com/pub/Collateral/MMBT4124LT1-D.PDF; ComponentLink2Description: DigiKey Link; ComponentLink2URL: http://digikey.com/product-detail/en/on-semiconductor/MMBT4124LT1G/MMBT4124LT1GOSCT-ND/2705123; LastUpdated: 3/11/2024 08:12:30; Lifecycle Status: Active; Minimum Order: 1; Mounting Type: Surface Mount; Operating Temperature: -55°C ~ 150°C (TJ); Package / Case: TO-236-3, SC-59, SOT-23-3; Packaging: TapeAndReel; PartId: 139; Part Status: Active; Price: 0.03; Series: -; Supplier 1: DigiKey; Supplier Part Number 1: MMBT4124LT1GOSCT-ND; Supplier Device Package: SOT-23-3 (TO-236); Transistor Type: NPN; Voltage - Collector Emitter Breakdown (Max): 25V
R15 R35 = AC0805JR-0710KL: RES SMD 10K OHM 5% 1/8W 0805; Manufacturer: Yageo; Power (Watts): 0.125W, 1/8W; Temperature Coefficient: ±100ppm/°C; Part Number: AC0805JR-0710KL; Value: 10 kOhms; ComponentLink1Description: Datasheet; ComponentLink1URL: https://www.yageo.com/upload/media/product/productsearch/datasheet/rchip/PYu-AC_51_RoHS_L_7.pdf; ComponentLink2Description: DigiKey Link; ComponentLink2URL: https://www.digikey.com/en/products/detail/yageo/AC0805JR-0710KL/5897043; Composition: Thick Film; Device Package: 0805 (2012 Metric); Features: Automotive AEC-Q200, Moisture Resistant; Height - Seated (Max): 0.024" (0.60mm); LastUpdated: 2/8/2024 21:01:11; Lifecycle Status: Active; Minimum Order: 1; Number of Terminations: 2; Operating Temperature: -55°C ~ 155°C; Package / Case: 0805 (2012 Metric); Packaging: TapeAndReel; PartId: 47032; Part Status: Active; Price: 0.01; Ratings: AEC-Q200; Resistance: 10 kOhms; Series: AC; Size / Dimension: 0.079" L x 0.049" W (2.00mm x 1.25mm); Supplier 1: DigiKey; Supplier Part Number 1: YAG3758CT-ND; Supplier Device Package: 0805; Tolerance: ±5%
R25 = 3430A2F510RTDF: 3430 A2 1% 510R 100PPM 1K RL; Manufacturer: TE Connectivity Passive Product; Power (Watts): 1W; Temperature Coefficient: ±100ppm/°C; Part Number: 3430A2F510RTDF; Value: 510 Ohms; ComponentLink2Description: DigiKey Link; ComponentLink2URL: https://www.digikey.com/en/products/detail/te-connectivity-passive-product/3430A2F510RTDF/17763734; Composition: Thick Film; Device Package: 0805 (2012 Metric); Features: Automotive AEC-Q200; Height - Seated (Max): 0.026" (0.65mm); LastUpdated: 2/8/2024 21:00:03; Lifecycle Status: Active; Minimum Order: 1; Number of Terminations: 2; Operating Temperature: -55°C ~ 155°C; Package / Case: 0805 (2012 Metric); Packaging: TapeAndReel; PartId: 77774; Part Status: Active; Price: 0.02; Ratings: AEC-Q200; Resistance: 510 Ohms; Series: 3430; Size / Dimension: 0.049" L x 0.079" W (1.25mm x 2.00mm); Supplier 1: DigiKey; Supplier Part Number 1: 1712-3430A2F510RTDFCT-ND; Supplier Device Package: 0508; Tolerance: ±1%
R45 = AA0805JR-070RL: RES SMD 0 OHM JUMPER 1/8W 0805; Manufacturer: Yageo; Part Number: AA0805JR-070RL; Value: 0 Ohms; ComponentLink1Description: Datasheet; ComponentLink1URL: https://www.yageo.com/upload/media/product/productsearch/datasheet/rchip/PYu-AA_51_RoHS_L_3.pdf; ComponentLink2Description: DigiKey Link; ComponentLink2URL: https://www.digikey.com/en/products/detail/yageo/AA0805JR-070RL/5890455; Composition: Thick Film; Device Package: 0805 (2012 Metric); Features: Anti-Sulfur, Automotive AEC-Q200, Moisture Resistant; Height - Seated (Max): 0.024" (0.60mm); LastUpdated: 2/8/2024 21:00:22; Lifecycle Status: Active; Minimum Order: 1; Number of Terminations: 2; Operating Temperature: -55°C ~ 155°C; Package / Case: 0805 (2012 Metric); Packaging: TapeAndReel; PartId: 74756; Part Status: Active; Price: 0.01; Ratings: AEC-Q200; Resistance: 0 Ohms; Series: AA; Size / Dimension: 0.079" L x 0.049" W (2.00mm x 1.25mm); Supplier 1: DigiKey; Supplier Part Number 1: 13-AA0805JR-070RLCT-ND; Supplier Device Package: 0805; Tolerance: Jumper
R55 R65 = AC0805FR-7W100RL: RES 100 OHM 1% 1/4W 0805; Manufacturer: Yageo; Power (Watts): 0.25W, 1/4W; Temperature Coefficient: ±100ppm/°C; Part Number: AC0805FR-7W100RL; Value: 100 Ohms; ComponentLink1Description: Datasheet; ComponentLink1URL: https://www.yageo.com/upload/media/product/productsearch/datasheet/rchip/PYu-AC_51_RoHS_L_8.pdf; ComponentLink2Description: DigiKey Link; ComponentLink2URL: https://www.digikey.com/en/products/detail/yageo/AC0805FR-7W100RL/12698833; Composition: Thick Film; Device Package: 0805 (2012 Metric); Features: Automotive AEC-Q200, Moisture Resistant; Height - Seated (Max): 0.024" (0.60mm); LastUpdated: 2/8/2024 21:00:29; Lifecycle Status: Active; Minimum Order: 1; Number of Terminations: 2; Operating Temperature: -55°C ~ 155°C; Package / Case: 0805 (2012 Metric); Packaging: TapeAndReel; PartId: 60606; Part Status: Active; Price: 0.01; Ratings: AEC-Q200; Resistance: 100 Ohms; Series: AC; Size / Dimension: 0.079" L x 0.049" W (2.00mm x 1.25mm); Supplier 1: DigiKey; Supplier Part Number 1: 13-AC0805FR-7W100RLCT-ND; Supplier Device Package: 0805; Tolerance: ±1%
R75 R85 R95 R105 R115 R125 = WJC0805LJUMPFNR: RES 0 OHM JUMPER 0805; Manufacturer: Littelfuse Inc.; Part Number: WJC0805LJUMPFNR; Value: 0 Ohms; ComponentLink1Description: Datasheet; ComponentLink1URL: https://media.digikey.com/pdf/Data%20Sheets/Littelfuse%20PDFs/WJC_Series_3-17-23.pdf; ComponentLink2Description: DigiKey Link; ComponentLink2URL: https://www.digikey.com/en/products/detail/littelfuse-inc/WJC0805LJUMPFNR/18795443; Composition: Metal Foil; Device Package: 0805 (2012 Metric); Features: Current Sense, High Voltage; Height - Seated (Max): 0.024" (0.60mm); LastUpdated: 2/8/2024 20:59:56; Lifecycle Status: Active; Minimum Order: 1; Number of Terminations: 2; Operating Temperature: -55°C ~ 170°C; Package / Case: 0805 (2012 Metric); Packaging: TapeAndReel; PartId: 80166; Price: 0.07; Resistance: 0 Ohms; Series: WJC; Size / Dimension: 0.079" L x 0.049" W (2.00mm x 1.25mm); Supplier 1: DigiKey; Supplier Part Number 1: 18-WJC0805LJUMPFNRCT-ND; Supplier Device Package: 0805; Tolerance: Jumper
R135 = AC0805FR-7W470RL: as R11 on sheet PowerSupply; Part Number: AC0805FR-7W470RL; Value: 470 Ohms; ComponentLink1Description: Datasheet; ComponentLink1URL: https://www.yageo.com/upload/media/product/productsearch/datasheet/rchip/PYu-AC_51_RoHS_L_9.pdf; ComponentLink2Description: DigiKey Link; ComponentLink2URL: https://www.digikey.com/en/products/detail/yageo/AC0805FR-7W470RL/16982114; Composition: Thick Film; Device Package: 0805 (2012 Metric); Features: Automotive AEC-Q200, Moisture Resistant; Height - Seated (Max): 0.024" (0.60mm); LastUpdated: 2/8/2024 21:00:08; Lifecycle Status: Active; Minimum Order: 1; Number of Terminations: 2; Operating Temperature: -55°C ~ 155°C; Package / Case: 0805 (2012 Metric); Packaging: TapeAndReel; PartId: 76423; Part Status: Active; Price: 0.01; Ratings: AEC-Q200; Resistance: 470 Ohms; Series: AC; Size / Dimension: 0.079" L x 0.049" W (2.00mm x 1.25mm); Supplier 1: DigiKey; Supplier Part Number 1: 13-AC0805FR-7W470RLCT-ND; Supplier Device Package: 0805; Tolerance: ±1%
U15 = STM32F407VGT6: No Description Available; Mfr_Name: STMicroelectronics; RefDes: RefDes; Type: Type
Y15 = CM8V-T1A-32.768KHZ-12.5PF-20PPM-TA-QA: CRYSTAL 32.7680KHZ 12.5PF SMD; Manufacturer: Micro Crystal AG; ESR (Equivalent Series Resistance): 70 kOhms; Frequency Tolerance: ±20ppm; Operating Mode: Fundamental; Part Number: CM8V-T1A-32.768KHZ-12.5PF-20PPM-TA-QA; ComponentLink1Description: Datasheet; ComponentLink1URL: https://www.microcrystal.com/fileadmin/Media/Products/32kHz/Datasheet/CM8V-T1A.pdf; ComponentLink2Description: DigiKey Link; ComponentLink2URL: https://www.digikey.com/en/products/detail/micro-crystal-ag/CM8V-T1A-32-768KHZ-12-5PF-20PPM-TA-QA/10499086; Frequency: 32.768 kHz; Height - Seated (Max): 0.024" (0.60mm); LastUpdated: 3/11/2024 08:14:55; Lifecycle Status: Active; Load Capacitance: 12.5pF; Minimum Order: 1; Mounting Type: Surface Mount; Operating Temperature: -40°C ~ 85°C; Package / Case: 2-SMD, No Lead; Packaging: TapeAndReel; PartId: 834; Part Status: Active; Price: 0.30; Ratings: AEC-Q200; Series: CM8V; Size / Dimension: 0.079" L x 0.047" W (2.00mm x 1.20mm); Supplier 1: DigiKey; Supplier Part Number 1: 2195-CM8V-T1A-32.768KHZ-12.5PF-20PPM-TA-QACT-ND; Type: kHz Crystal (Tuning Fork); Value: 32.768 kHz
Y25 = NX8045GB-8.000000MHZ: CRYSTAL 8.0000MHZ 8PF SMD; Manufacturer: NDK America, Inc.; ESR (Equivalent Series Resistance): 200 Ohms; Frequency Stability: ±50ppm; Operating Mode: Fundamental; Part Number: NX8045GB-8.000000MHZ; ComponentLink1Description: Datasheet; ComponentLink1URL: //media.digikey.com/pdf/Data%20Sheets/NDK%20PDFs/NX8045GB.pdf; ComponentLink2Description: DigiKey Link; ComponentLink2URL: http://digikey.com/product-detail/en/ndk-america-inc/NX8045GB-8.000000MHZ/644-1018-1-ND/1128890; Frequency: 8MHz; Frequency Tolerance: ±50ppm; Height - Seated (Max): 0.079" (2.00mm); LastUpdated: 3/11/2024 07:54:40; Lifecycle Status: Active; Load Capacitance: 8pF; Minimum Order: 1; Mounting Type: Surface Mount; Operating Temperature: -10°C ~ 70°C; Package / Case: 2-SMD, No Lead; Packaging: TapeAndReel; PartId: 653; Part Status: Active; Price: 0.30; Series: NX8045GB; Size / Dimension: 0.315" L x 0.177" W (8.00mm x 4.50mm); Supplier 1: DigiKey; Supplier Part Number 1: 644-1018-1-ND; Type: MHz Crystal; Value: 8MHz